# EAGLE design motherboard_v3 (EAGLE 9.1.3)
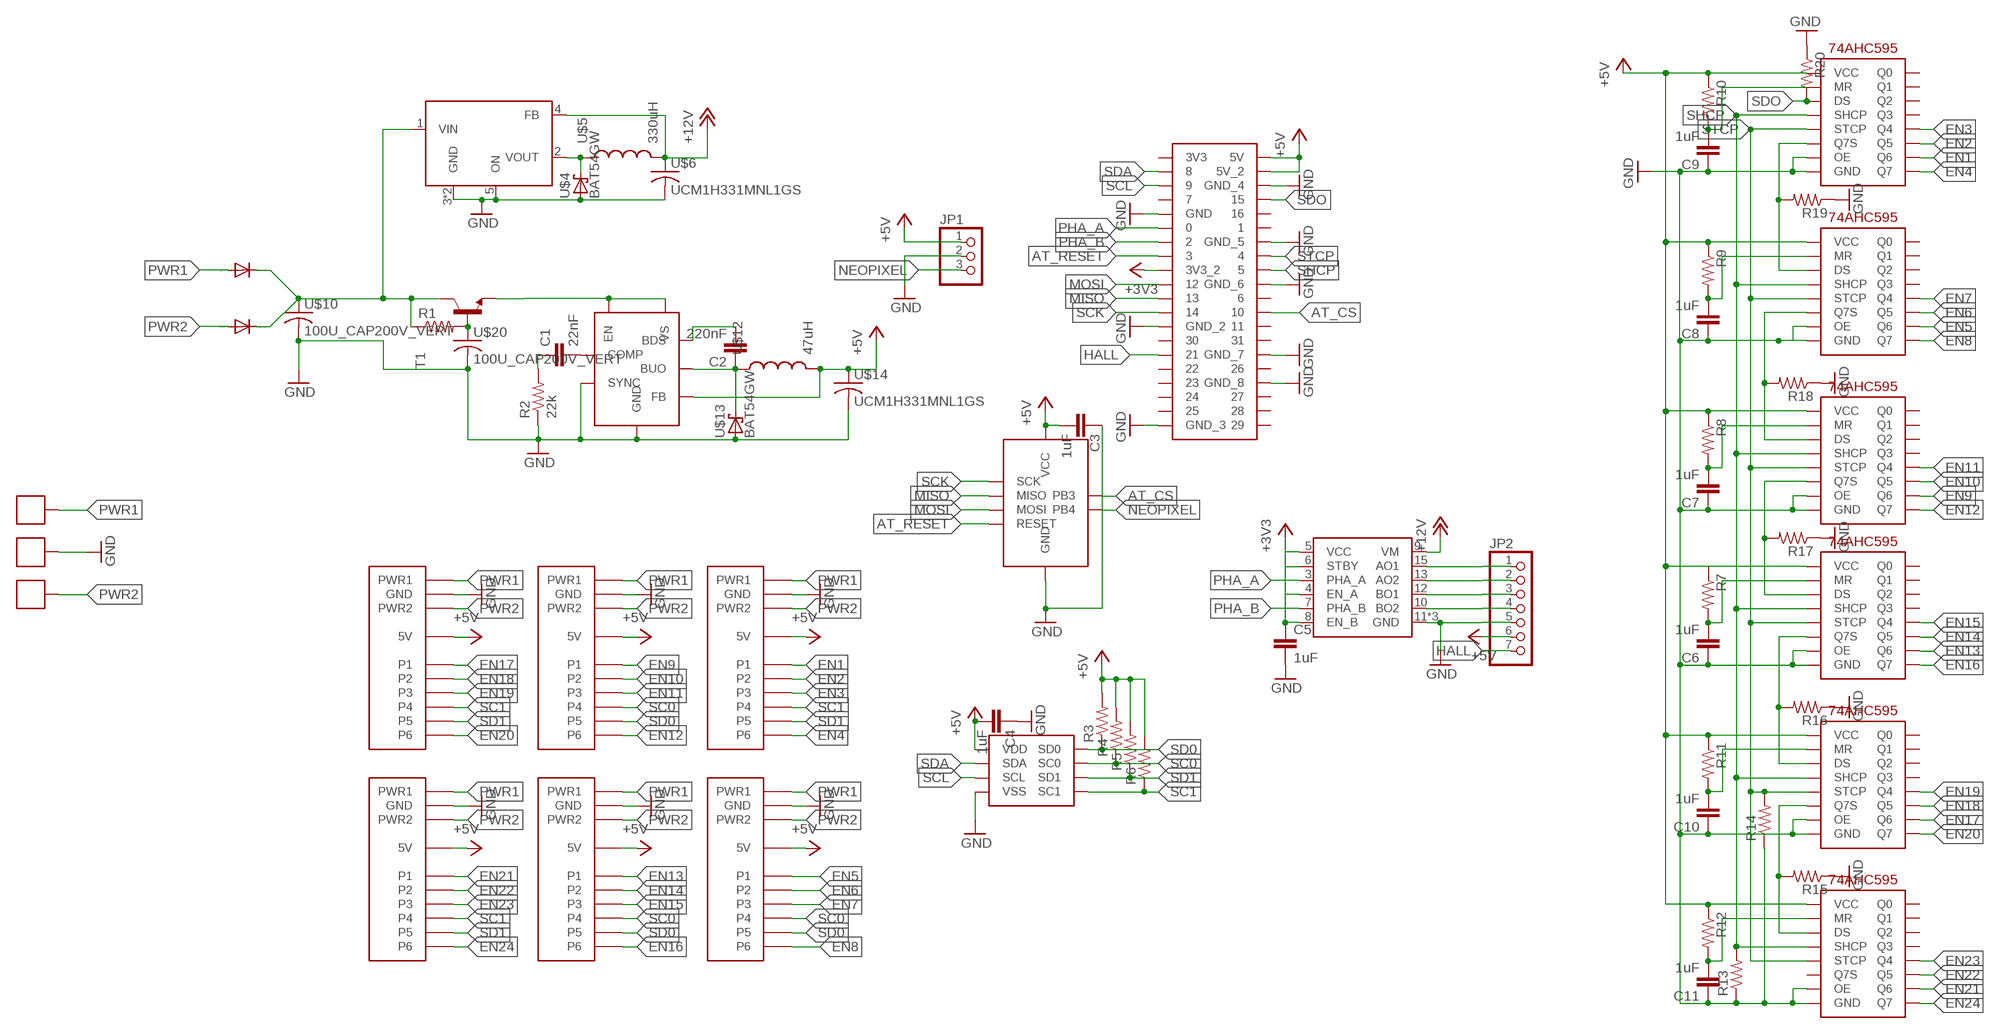
[diagram p0: schematic, sheet 1]

## Parts
B1  PCIE_SOCKET  [PCIE_SOCKET]
B2  PCIE_SOCKET  [PCIE_SOCKET]
B3  PCIE_SOCKET  [PCIE_SOCKET]
B4  PCIE_SOCKET  [PCIE_SOCKET]
B5  PCIE_SOCKET  [PCIE_SOCKET]
B6  PCIE_SOCKET  [PCIE_SOCKET]
C1  22nF  C-EUC0805  [C0805]
C2  220nF  C-EUC0805  [C0805]
C3  1uF  C-EUC0805  [C0805]
C4  1uF  C-EUC0805  [C0805]
C5  1uF  C-EUC0805  [C0805]
C6  1uF  C-EUC0805  [C0805]
C7  1uF  C-EUC0805  [C0805]
C8  1uF  C-EUC0805  [C0805]
C9  1uF  C-EUC0805  [C0805]
C10  1uF  C-EUC0805  [C0805]
C11  1uF  C-EUC0805  [C0805]
JP1  PINHD-1X3  [1X03]
JP2  PINHD-1X7  [1X07]
R1  R-US_R1206  [R1206]
R2  22k  R-US_R1206  [R1206]
R3  R-US_R0805  [R0805]
R4  R-US_R0805  [R0805]
R5  R-US_R0805  [R0805]
R6  R-US_R0805  [R0805]
R7  R-US_R0805  [R0805]
R8  R-US_R0805  [R0805]
R9  R-US_R0805  [R0805]
R10  R-US_R0805  [R0805]
R11  R-US_R0805  [R0805]
R12  R-US_R0805  [R0805]
R13  R-US_R0805  [R0805]
R14  R-US_R0805  [R0805]
R15  R-US_R0805  [R0805]
R16  R-US_R0805  [R0805]
R17  R-US_R0805  [R0805]
R18  R-US_R0805  [R0805]
R19  R-US_R0805  [R0805]
R20  R-US_R0805  [R0805]
T1  -NPN-SOT23-EBC  [SOT23-EBC]
U1  IFX91041EJV50XUMA1  [SOIC127P600X170-8]
U$1  RPI_SOCKET  [40PIN_SOCKET]
U$2  TC78H620FNG  [SSOP16]
U$3  TL2575HV-12IKTTR  [TO170P1524X483-6]
U$4  BAT54GW  [SOD3616X130]
U$5  330uH  SRN8040TA  [SRN8040TA]
U$6  UCM1H331MNL1GS  [CAPAE1030X1050]
U$7  74HC595_QFN  [QFN50P250X350X100-16]
U$8  BAS16GW  [SOD3616X130]
U$9  BAS16GW  [SOD3616X130]
U$10  100U_CAP200V_VERT  [VERT_CAP]
U$11  ATTINY85  [SOIC127P599X175-8]
U$12  47uH  SRN8040TA  [SRN8040TA]
U$13  BAT54GW  [SOD3616X130]
U$14  UCM1H331MNL1GS  [CAPAE1030X1050]
U$17  1935310  [1935310]
U$18  1935310  [1935310]
U$19  1935310  [1935310]
U$20  100U_CAP200V_VERT  [VERT_CAP]
U$21  PCA9540BDP  [TSSOP8]
U$22  74HC595_QFN  [QFN50P250X350X100-16]
U$23  74HC595_QFN  [QFN50P250X350X100-16]
U$24  74HC595_QFN  [QFN50P250X350X100-16]
U$25  74HC595_QFN  [QFN50P250X350X100-16]
U$26  74HC595_QFN  [QFN50P250X350X100-16]

## Nets
+3V3: C5.1 U$1.P17(3V3_2) U$2.4(EN_A) U$2.5(VCC) U$2.6(STBY) U$2.8(EN_B)
+5V: B1.5V_1(5V) B1.5V_2(5V) B2.5V_1(5V) B2.5V_2(5V) B3.5V_1(5V) B3.5V_2(5V) B4.5V_1(5V) B4.5V_2(5V) B5.5V_1(5V) B5.5V_2(5V) B6.5V_1(5V) B6.5V_2(5V) C3.2 C4.2 JP1.1 JP2.6 R3.2 R4.2 R5.2 R6.2 R7.1 R8.1 R9.1 R10.1 R11.1 R12.1 U1.4(FB) U$1.P2(5V) U$1.P4(5V_2) U$7.P16(VCC) U$11.8(VCC) U$12.P$2 U$14.1 U$21.3(VDD) U$22.P16(VCC) U$23.P16(VCC) U$24.P16(VCC) U$25.P16(VCC) U$26.P16(VCC)
+12V: U$2.9(VM) U$3.4(FB) U$5.P$2 U$6.1
AT_CS: U$1.P24 U$11.2(PB3)
AT_RESET: U$1.P15 U$11.1(RESET)
EN1: B1.P1 U$7.P6(Q6)
EN2: B1.P2 U$7.P5(Q5)
EN3: B1.P3 U$7.P4(Q4)
EN4: B1.P6 U$7.P7(Q7)
EN5: B2.P1 U$22.P6(Q6)
EN6: B2.P2 U$22.P5(Q5)
EN7: B2.P3 U$22.P4(Q4)
EN8: B2.P6 U$22.P7(Q7)
EN9: B3.P1 U$23.P6(Q6)
EN10: B3.P2 U$23.P5(Q5)
EN11: B3.P3 U$23.P4(Q4)
EN12: B3.P6 U$23.P7(Q7)
EN13: B4.P1 U$24.P6(Q6)
EN14: B4.P2 U$24.P5(Q5)
EN15: B4.P3 U$24.P4(Q4)
EN16: B4.P6 U$24.P7(Q7)
EN17: B5.P1 U$25.P6(Q6)
EN18: B5.P2 U$25.P5(Q5)
EN19: B5.P3 U$25.P4(Q4)
EN20: B5.P6 U$25.P7(Q7)
EN21: B6.P1 U$26.P6(Q6)
EN22: B6.P2 U$26.P5(Q5)
EN23: B6.P3 U$26.P4(Q4)
EN24: B6.P6 U$26.P7(Q7)
GND: B1.GND1(GND) B1.GND2(GND) B2.GND1(GND) B2.GND2(GND) B3.GND1(GND) B3.GND2(GND) B4.GND1(GND) B4.GND2(GND) B5.GND1(GND) B5.GND2(GND) B6.GND1(GND) B6.GND2(GND) C3.1 C4.1 C5.2 C6.1 C7.1 C8.1 C9.1 C10.1 C11.1 JP1.2 JP2.5 R2.1 R13.1 R14.1 R15.1 R16.1 R17.1 R18.1 R19.1 R20.1 U1.1(SYNC) U1.2(GND) U1.PAD(GND) U$1.P6(GND_4) U$1.P9(GND) U$1.P14(GND_5) U$1.P20(GND_6) U$1.P25(GND_2) U$1.P30(GND_7) U$1.P34(GND_8) U$1.P39(GND_3) U$2.11(GND) U$2.14(GND) U$2.16(GND) U$3.3(GND) U$3.5(ON) U$3.6(GND) U$4.2(A) U$6.2 U$7.P8(GND) U$7.P13(OE) U$7.P$1(GND) U$10.P$4 U$11.4(GND) U$13.2(A) U$14.2 U$18.P$1 U$18.P$2 U$20.P$4 U$21.6(VSS) U$22.P8(GND) U$22.P13(OE) U$22.P$1(GND) U$23.P8(GND) U$23.P13(OE) U$23.P$1(GND) U$24.P8(GND) U$24.P13(OE) U$24.P$1(GND) U$25.P8(GND) U$25.P13(OE) U$25.P$1(GND) U$26.P8(GND) U$26.P13(OE) U$26.P$1(GND)
HALL: JP2.7 U$1.P29
MISO: U$1.P21 U$11.6(MISO)
MOSI: U$1.P19 U$11.5(MOSI)
N$1: T1.E U1.7(EN) U1.8(VS)
N$2: R1.2 T1.B U$20.P$3
N$3: R1.1 T1.C U$3.1(VIN) U$8.1(C) U$9.1(C) U$10.P$3
N$4: C1.2 U1.3(COMP)
N$5: C1.1 R2.2
N$6: C2.2 U1.5(BDS)
N$7: C2.1 U1.6(BUO) U$12.P$1 U$13.1(C)
N$8: R19.2 U$7.P9(Q7S) U$22.P14(DS)
N$9: JP2.1 U$2.15(AO1)
N$10: JP2.2 U$2.13(AO2)
N$11: JP2.3 U$2.12(BO1)
N$12: JP2.4 U$2.10(BO2)
N$13: U$3.2(VOUT) U$4.1(C) U$5.P$1
N$14: C6.2 R7.2 U$24.P10(MR)
N$15: R18.2 U$22.P9(Q7S) U$23.P14(DS)
N$16: R17.2 U$23.P9(Q7S) U$24.P14(DS)
N$17: C7.2 R8.2 U$23.P10(MR)
N$18: C8.2 R9.2 U$22.P10(MR)
N$19: C9.2 R10.2 U$7.P10(MR)
N$20: R16.2 U$24.P9(Q7S) U$25.P14(DS)
N$21: C10.2 R11.2 U$25.P10(MR)
N$23: C11.2 R12.2 U$26.P10(MR)
N$24: R15.2 U$25.P9(Q7S) U$26.P14(DS)
NEOPIXEL: JP1.3 U$11.3(PB4)
PHA_A: U$1.P11 U$2.3(PHA_A)
PHA_B: U$1.P13 U$2.7(PHA_B)
PWR1: B1.PWR1_1(PWR1) B1.PWR1_2(PWR1) B2.PWR1_1(PWR1) B2.PWR1_2(PWR1) B3.PWR1_1(PWR1) B3.PWR1_2(PWR1) B4.PWR1_1(PWR1) B4.PWR1_2(PWR1) B5.PWR1_1(PWR1) B5.PWR1_2(PWR1) B6.PWR1_1(PWR1) B6.PWR1_2(PWR1) U$8.2(A) U$17.P$1 U$17.P$2
PWR2: B1.PWR2_1(PWR2) B1.PWR2_2(PWR2) B2.PWR2_1(PWR2) B2.PWR2_2(PWR2) B3.PWR2_1(PWR2) B3.PWR2_2(PWR2) B4.PWR2_1(PWR2) B4.PWR2_2(PWR2) B5.PWR2_1(PWR2) B5.PWR2_2(PWR2) B6.PWR2_1(PWR2) B6.PWR2_2(PWR2) U$9.2(A) U$19.P$1 U$19.P$2
SC0: B2.P4 B3.P4 B4.P4 R4.1 U$21.5(SC0)
SC1: B1.P4 B5.P4 B6.P4 R6.1 U$21.8(SC1)
SCK: U$1.P23 U$11.7(SCK)
SCL: U$1.P5 U$21.1(SCL)
SD0: B2.P5 B3.P5 B4.P5 R3.1 U$21.4(SD0)
SD1: B1.P5 B5.P5 B6.P5 R5.1 U$21.7(SD1)
SDA: U$1.P3 U$21.2(SDA)
SDO: R20.2 U$1.P8 U$7.P14(DS)
SHCP: R13.2 U$1.P18 U$7.P11(SHCP) U$22.P11(SHCP) U$23.P11(SHCP) U$24.P11(SHCP) U$25.P11(SHCP) U$26.P11(SHCP)
STCP: R14.2 U$1.P16 U$7.P12(STCP) U$22.P12(STCP) U$23.P12(STCP) U$24.P12(STCP) U$25.P12(STCP) U$26.P12(STCP)
Unconnected: U$1.P1(3V3) U$1.P7 U$1.P10 U$1.P12 U$1.P22 U$1.P26 U$1.P27 U$1.P28 U$1.P31 U$1.P32 U$1.P33 U$1.P35 U$1.P36 U$1.P37 U$1.P38 U$1.P40 U$7.P1(Q1) U$7.P2(Q2) U$7.P3(Q3) U$7.P15(Q0) U$22.P1(Q1) U$22.P2(Q2) U$22.P3(Q3) U$22.P15(Q0) U$23.P1(Q1) U$23.P2(Q2) U$23.P3(Q3) U$23.P15(Q0) U$24.P1(Q1) U$24.P2(Q2) U$24.P3(Q3) U$24.P15(Q0) U$25.P1(Q1) U$25.P2(Q2) U$25.P3(Q3) U$25.P15(Q0) U$26.P1(Q1) U$26.P2(Q2) U$26.P3(Q3) U$26.P9(Q7S) U$26.P15(Q0)

## Library data of the parts
B1-B6 = tide_clock:PCIE_SOCKET
C1-C11 = resistor:C-EU: CAPACITOR, European symbol
JP1 = pinhead:PINHD-1X3: PIN HEADER
JP2 = pinhead:PINHD-1X7: PIN HEADER
R1-R20 = resistor:R-US_: RESISTOR, American symbol
T1 = transistor:*-NPN-: NPN Transistror BF959 corrected 2008.03.06
U1 = tide_clock:IFX91041EJV50XUMA1
U$1 = tide_clock:RPI_SOCKET
U$2 = tide_clock:TC78H620FNG
U$3 = tide_clock:TL2575HV-12IKTTR
U$4 U$13 = tide_clock:BAT54GW
U$5 U$12 = tide_clock:SRN8040TA
U$6 U$14 = tide_clock:UCM1H331MNL1GS
U$7 U$22-U$26 = tide_clock:74HC595_QFN
U$8 U$9 = tide_clock:BAS16GW
U$10 U$20 = tide_clock:100U_CAP
U$11 = tide_clock:ATTINY85
U$17-U$19 = tide_clock:1935310
U$21 = tide_clock:PCA9540BDP

## Board
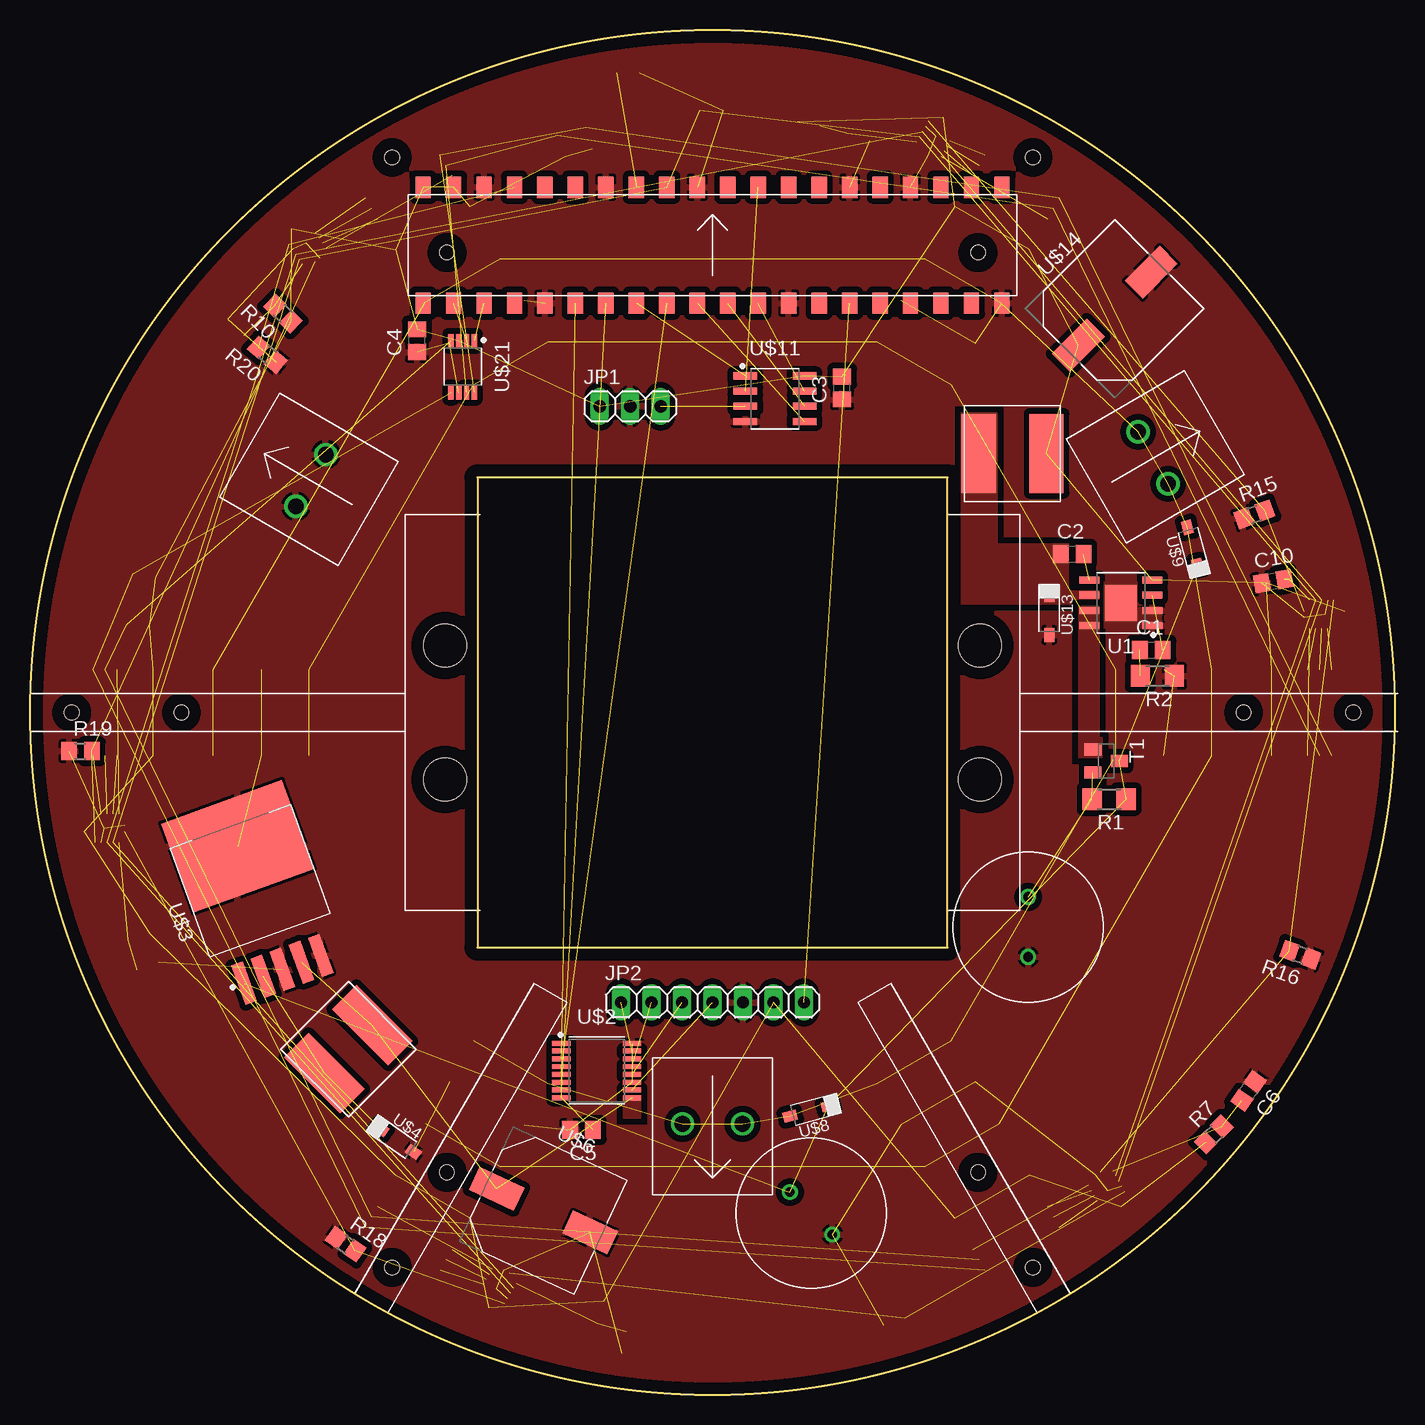
[diagram p1: board, top side]
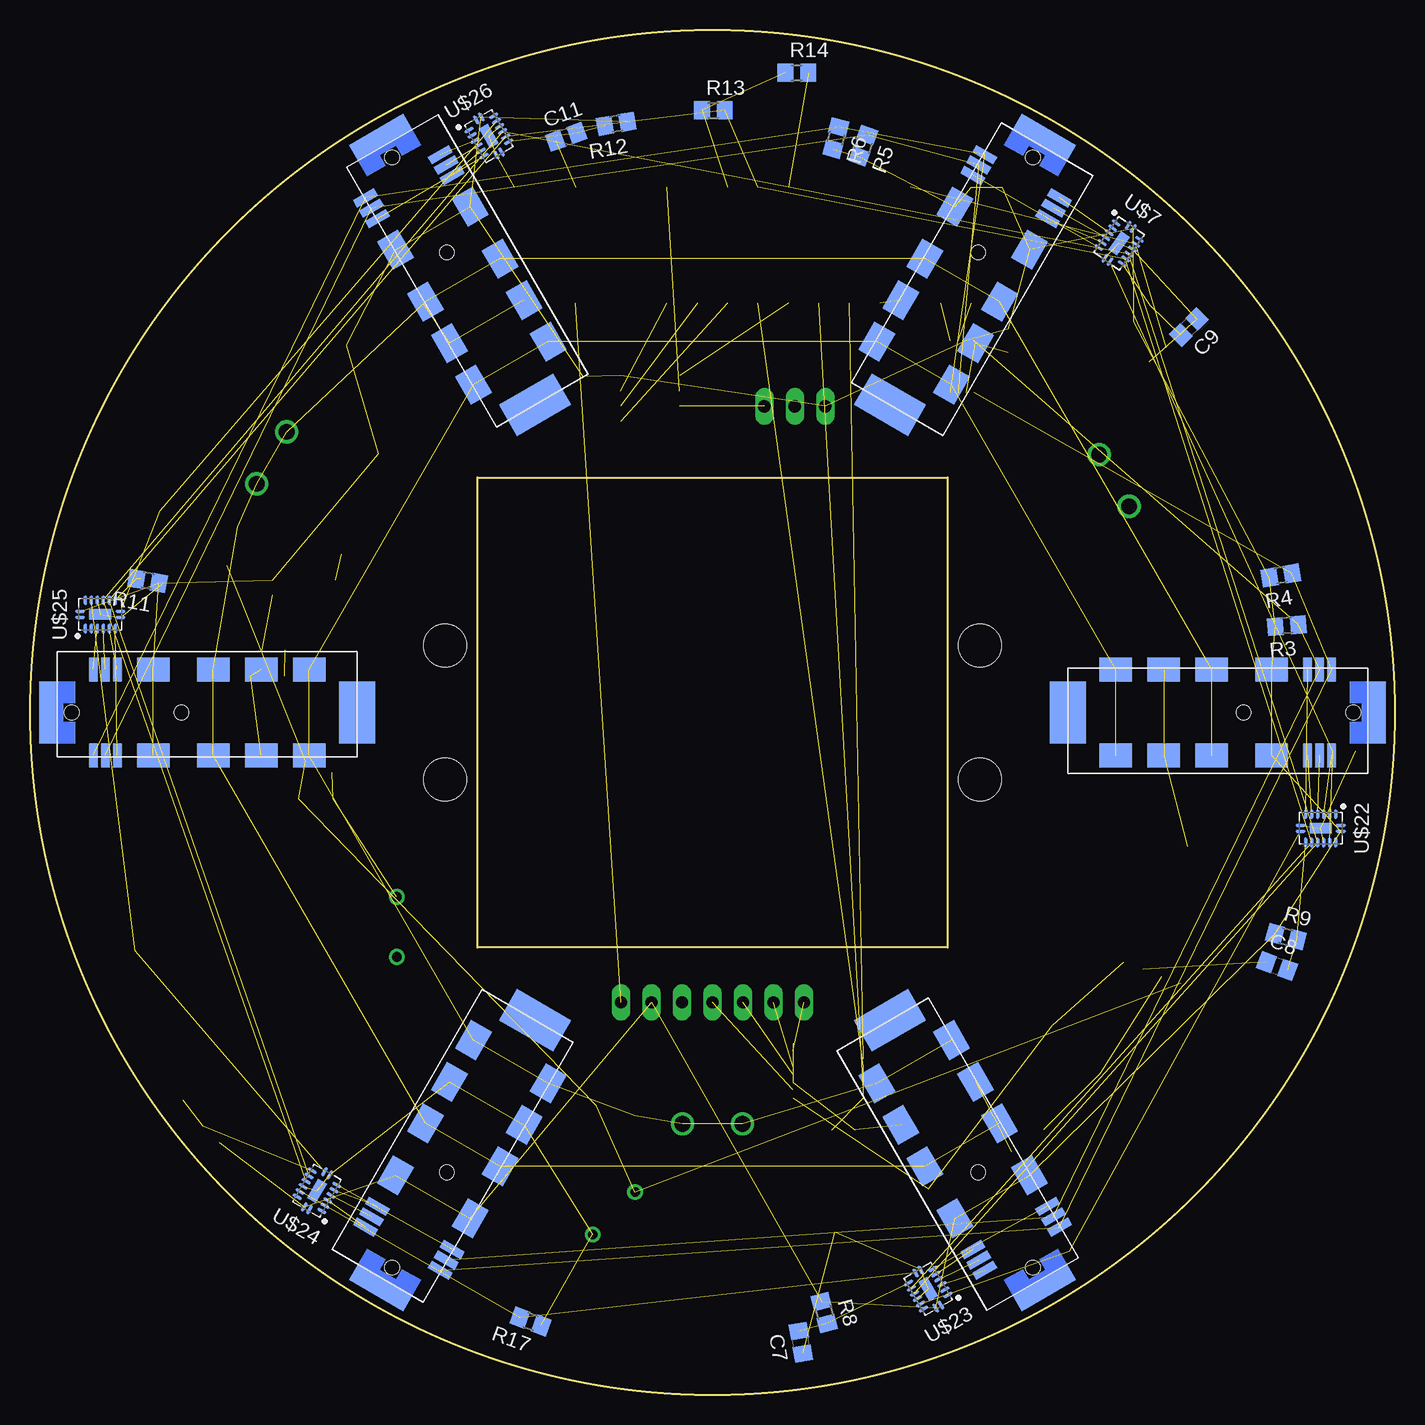
[diagram p2: board, bottom side, seen from below]

Size 113.79 x 113.79 mm. Coordinates in mm from the lower left corner, seen from the top.
Outline: 37.3,37.3 76.49,37.3 76.49,76.49 37.3,76.49 37.3,37.3
Outline: circle at 56.9,56.9 radius 56.9
Copper layers (1*16): Top 0.035mm / dielectric 1.5mm / Bottom 0.035mm
Design rules "default": minimum track width 6mil, minimum drill 0.35mm, track to track 6mil, track to pad 6mil, pad to pad 6mil, via to via 6mil, smd to smd 6mil, copper to edge 40mil, drill to drill 6mil, minimum pad ring 10mil, minimum via ring 8mil, stop-mask expansion 4mil, vias tented up to drill 0mil, thermal gap 10mil
Holes 3.56 mm at 79.19,51.32 79.19,62.47 34.6,51.32 34.6,62.47

### Footprints (pad centres in the part's own frame; a part is rotated, then mirrored left to right if it is on the bottom)
PCIE_SOCKET = smd 2.7 x 2: 5V_1 2.5,-3.6; 5V_2 2.5,3.6; GND1 -6.5,3.6; GND2 -6.5,-3.6; PWR1_1 -10.5,3.6; PWR1_2 -10.5,-3.6; PWR2_1 -2.5,3.6; PWR2_2 -2.5,-3.6 | smd 3 x 5.2: LEFT_TAB -14.5,0 | smd 0.7 x 2: P1 5.5,-3.6; P2 6.5,-3.6; P3 7.5,-3.6; P4 7.5,3.6; P5 6.5,3.6; P6 5.5,3.6 | smd 1.5 x 5.2: RIGHT_TAB 11.25,0 | hole 1.2: 0.15,0; 9.3,0
C0805 = smd 1.3 x 1.5: 1 -0.95,0; 2 0.95,0
1X03 = drill 1.016 long: 1 -2.54,0; 2 0,0; 3 2.54,0
1X07 = drill 1.016 long: 1 -7.62,0; 2 -5.08,0; 3 -2.54,0; 4 0,0; 5 2.54,0; 6 5.08,0; 7 7.62,0
R1206 = smd 1.6 x 1.803: 1 -1.422,0; 2 1.422,0
R0805 = smd 1.3 x 1.5: 1 -0.95,0; 2 0.95,0
SOT23-EBC = smd 1 x 1.4: B 0.95,-1.1; C 0,1.1; E -0.95,-1.1
SOIC127P600X170-8 = smd 1.655 x 0.592: 1 -2.63,1.905; 2 -2.63,0.635; 3 -2.63,-0.635; 4 -2.63,-1.905; 5 2.63,-1.905; 6 2.63,-0.635; 7 2.63,0.635; 8 2.63,1.905 | smd 2.65 x 3: PAD 0,0
40PIN_SOCKET = smd 1.27 x 1.78: P1 -24.13,-4.825; P2 -24.13,4.825; P3 -21.59,-4.825; P4 -21.59,4.825; P5 -19.05,-4.825; P6 -19.05,4.825; P7 -16.51,-4.825; P8 -16.51,4.825; P9 -13.97,-4.825; P10 -13.97,4.825; P11 -11.43,-4.825; P12 -11.43,4.825; P13 -8.89,-4.825; P14 -8.89,4.825; P15 -6.35,-4.825; P16 -6.35,4.825; P17 -3.81,-4.825; P18 -3.81,4.825; P19 -1.27,-4.825; P20 -1.27,4.825; P21 1.27,-4.825; P22 1.27,4.825; P23 3.81,-4.825; P24 3.81,4.825; P25 6.35,-4.825; P26 6.35,4.825; P27 8.89,-4.825; P28 8.89,4.825; P29 11.43,-4.825; P30 11.43,4.825; P31 13.97,-4.825; P32 13.97,4.825; P33 16.51,-4.825; P34 16.51,4.825; P35 19.05,-4.825; P36 19.05,4.825; P37 21.59,-4.825; P38 21.59,4.825; P39 24.13,-4.825; P40 24.13,4.825
SSOP16 = smd 1.515 x 0.409: 1 -2.948,2.275; 2 -2.948,1.625; 3 -2.948,0.975; 4 -2.948,0.325; 5 -2.948,-0.325; 6 -2.948,-0.975; 7 -2.948,-1.625; 8 -2.948,-2.275; 9 2.948,-2.275; 10 2.948,-1.625; 11 2.948,-0.975; 12 2.948,-0.325; 13 2.948,0.325; 14 2.948,0.975; 15 2.948,1.625; 16 2.948,2.275
TO170P1524X483-6 = smd 3.469 x 0.994: 1 -6.558,3.4; 2 -6.558,1.7; 3 -6.558,0; 4 -6.558,-1.7; 5 -6.558,-3.4 | smd 7.885 x 10.7: 6 4.35,0
SOD3616X130 = smd 1.159 x 0.839: 1 -1.656,0; 2 1.656,0
SRN8040TA = smd 6.6 x 2.85: P$1 0,2.825; P$2 0,-2.825
CAPAE1030X1050 = smd 4.11 x 2.12: 1 -4.299,0; 2 4.299,0
QFN50P250X350X100-16 = smd 0.264 x 0.86: P1 -0.25,1.685; P8 -0.25,-1.685; P9 0.25,-1.685; P16 0.25,1.685 | smd 0.86 x 0.264: P2 -1.185,1.25; P3 -1.185,0.75; P4 -1.185,0.25; P5 -1.185,-0.25; P6 -1.185,-0.75; P7 -1.185,-1.25; P10 1.185,-1.25; P11 1.185,-0.75; P12 1.185,-0.25; P13 1.185,0.25; P14 1.185,0.75; P15 1.185,1.25 | smd 0.85 x 1.85: P$1 0,0
VERT_CAP = drill 0.8: P$3 -2.5,0; P$4 2.5,0
SOIC127P599X175-8 = smd 1.972 x 0.599: 1 -2.472,1.905; 2 -2.472,0.635; 3 -2.472,-0.635; 4 -2.472,-1.905; 5 2.472,-1.905; 6 2.472,-0.635; 7 2.472,0.635; 8 2.472,1.905
1935310 = drill 1.3: P$1 2.5,0; P$2 -2.5,0
TSSOP8 = smd 1.15 x 0.45: 1 -2.153,0.975; 2 -2.153,0.325; 3 -2.153,-0.325; 4 -2.153,-0.975; 5 2.153,-0.975; 6 2.153,-0.325; 7 2.153,0.325; 8 2.153,0.975

### Placement (x,y rotation side)
B1  34.84,95.1 60 bottom
B2  12.78,56.9 0 bottom
B3  34.84,18.69 300 bottom
B4  78.95,18.69 240 bottom
B5  101.01,56.9 180 bottom
B6  78.95,95.1 120 bottom
C1  93.47,62.1 0 top
C2  86.87,70.1 0 top
C3  67.69,83.95 90 top
C4  32.26,87.88 90 top
C5  45.97,22.1 180 top
C6  101.57,25.35 235 top
C7  49.53,4.39 100 bottom
C8  9.83,35.76 340 bottom
C9  17.17,89.03 225 bottom
C10  103.63,67.84 10 top
C11  69.09,104.88 20 bottom
JP1  50.04,82.42 0 top
JP2  56.9,32.73 0 top
R1  89.96,49.67 180 top
R2  93.98,59.94 180 top
R3  9.02,64.14 185 bottom
R4  9.53,68.33 190 bottom
R5  44.32,104.14 250 bottom
R6  46.61,104.78 255 bottom
R7  98.68,21.72 45 top
R8  47.57,6.88 285 bottom
R9  9.09,38.2 345 bottom
R10  21.08,90.14 135 top
R11  103.99,67.87 170 bottom
R12  64.92,105.97 190 bottom
R13  56.82,107.09 0 bottom
R14  49.86,110.24 0 bottom
R15  102.06,73.41 20 top
R16  105.89,36.7 160 top
R17  72.06,6.12 160 bottom
R18  26.31,12.57 325 top
R19  4.22,53.67 0 top
R20  19.79,86.72 140 top
T1  89.71,52.85 270 top
U1  90.93,66.04 180 top
U$1  56.9,95.85 0 top
U$2  47.24,27.05 0 top
U$3  18.8,41.66 110 top
U$4  30.61,21.21 325 top
U$5  26.54,28.83 135 top
U$6  42.8,15.37 335 top
U$7  23,96 325 bottom
U$8  64.97,23.68 195 top
U$9  96.91,70.73 105 top
U$10  65.12,15.15 315 top
U$11  62.1,83.06 0 top
U$12  81.92,78.49 90 top
U$13  84.96,65.02 270 top
U$14  90.42,90.55 45 top
U$17  56.9,22.6 0 top
U$18  23.4,76.23 240 top
U$19  93.64,78.11 120 top
U$20  83.21,39.02 270 top
U$21  36.07,85.72 270 top
U$22  6.2,47.24 270 bottom
U$23  38.91,8.84 210 bottom
U$24  89.87,17.02 150 bottom
U$25  107.92,65.07 90 bottom
U$26  75.54,104.95 30 bottom

### Tracks (layer width: path | path; a pad name or v marks a point on that pad's centre or on a via)
+3V3  (5 unrouted)
+5V  (38 unrouted)
+12V  (3 unrouted)
  pour Top (no thermals): 49.43,24.99 50.95,24.99 50.95,23.06 49.43,23.06
AT_CS  (1 unrouted)
AT_RESET  (1 unrouted)
EN1  (1 unrouted)
EN2  (1 unrouted)
EN3  (1 unrouted)
EN4  (1 unrouted)
EN5  (1 unrouted)
EN6  (1 unrouted)
EN7  (1 unrouted)
EN8  (1 unrouted)
EN9  (1 unrouted)
EN10  (1 unrouted)
EN11  (1 unrouted)
EN12  (1 unrouted)
EN13  (1 unrouted)
EN14  (1 unrouted)
EN15  (1 unrouted)
EN16  (1 unrouted)
EN17  (1 unrouted)
EN18  (1 unrouted)
EN19  (1 unrouted)
EN20  (1 unrouted)
EN21  (1 unrouted)
EN22  (1 unrouted)
EN23  (1 unrouted)
EN24  (1 unrouted)
GND  (41 unrouted)
  pour Top (isolate 0.508, rank 5): 0,0 113.79,0 113.79,113.79 0,113.79
  pour Top (no thermals): 89.53,67.82 92.33,67.82 92.33,65.66 94.36,65.66 94.36,63.88 89.53,63.88
HALL  (1 unrouted)
MISO  (1 unrouted)
MOSI  (1 unrouted)
N$1
  pour Top (no thermals): 87.38,65.79 89.15,65.79 89.15,54.86 89.41,54.86 89.41,53.09 88.01,53.09 87.38,53.09
N$2  (2 unrouted)
N$3  (5 unrouted)
N$4  (1 unrouted)
N$5  (1 unrouted)
N$6  (1 unrouted)
N$7
  pour Top (no thermals): 89.15,67.06 89.15,66.29 86.87,66.29 86.87,65.91 77.6,65.91 77.6,74.93 77.6,81.92 80.64,81.92 80.64,70.99 86.61,70.99 86.61,67.06
N$8  (2 unrouted)
N$9  (1 unrouted)
N$10  (1 unrouted)
N$11  (1 unrouted)
N$12  (1 unrouted)
N$13  (2 unrouted)
N$14  (2 unrouted)
N$15  (2 unrouted)
N$16  (2 unrouted)
N$17  (2 unrouted)
N$18  (2 unrouted)
N$19  (2 unrouted)
N$20  (2 unrouted)
N$21  (2 unrouted)
N$23  (2 unrouted)
N$24  (2 unrouted)
NEOPIXEL  (1 unrouted)
PHA_A  (1 unrouted)
PHA_B  (1 unrouted)
PWR1  (14 unrouted)
PWR2  (14 unrouted)
SC0  (4 unrouted)
SC1  (4 unrouted)
SCK  (1 unrouted)
SCL  (1 unrouted)
SD0  (4 unrouted)
SD1  (4 unrouted)
SDA  (1 unrouted)
SDO  (2 unrouted)
SHCP  (7 unrouted)
STCP  (7 unrouted)